# Altium schematic sheet FT232RLschematic.SchDoc
size A4; SheetNumber: 1; SheetTotal: 1
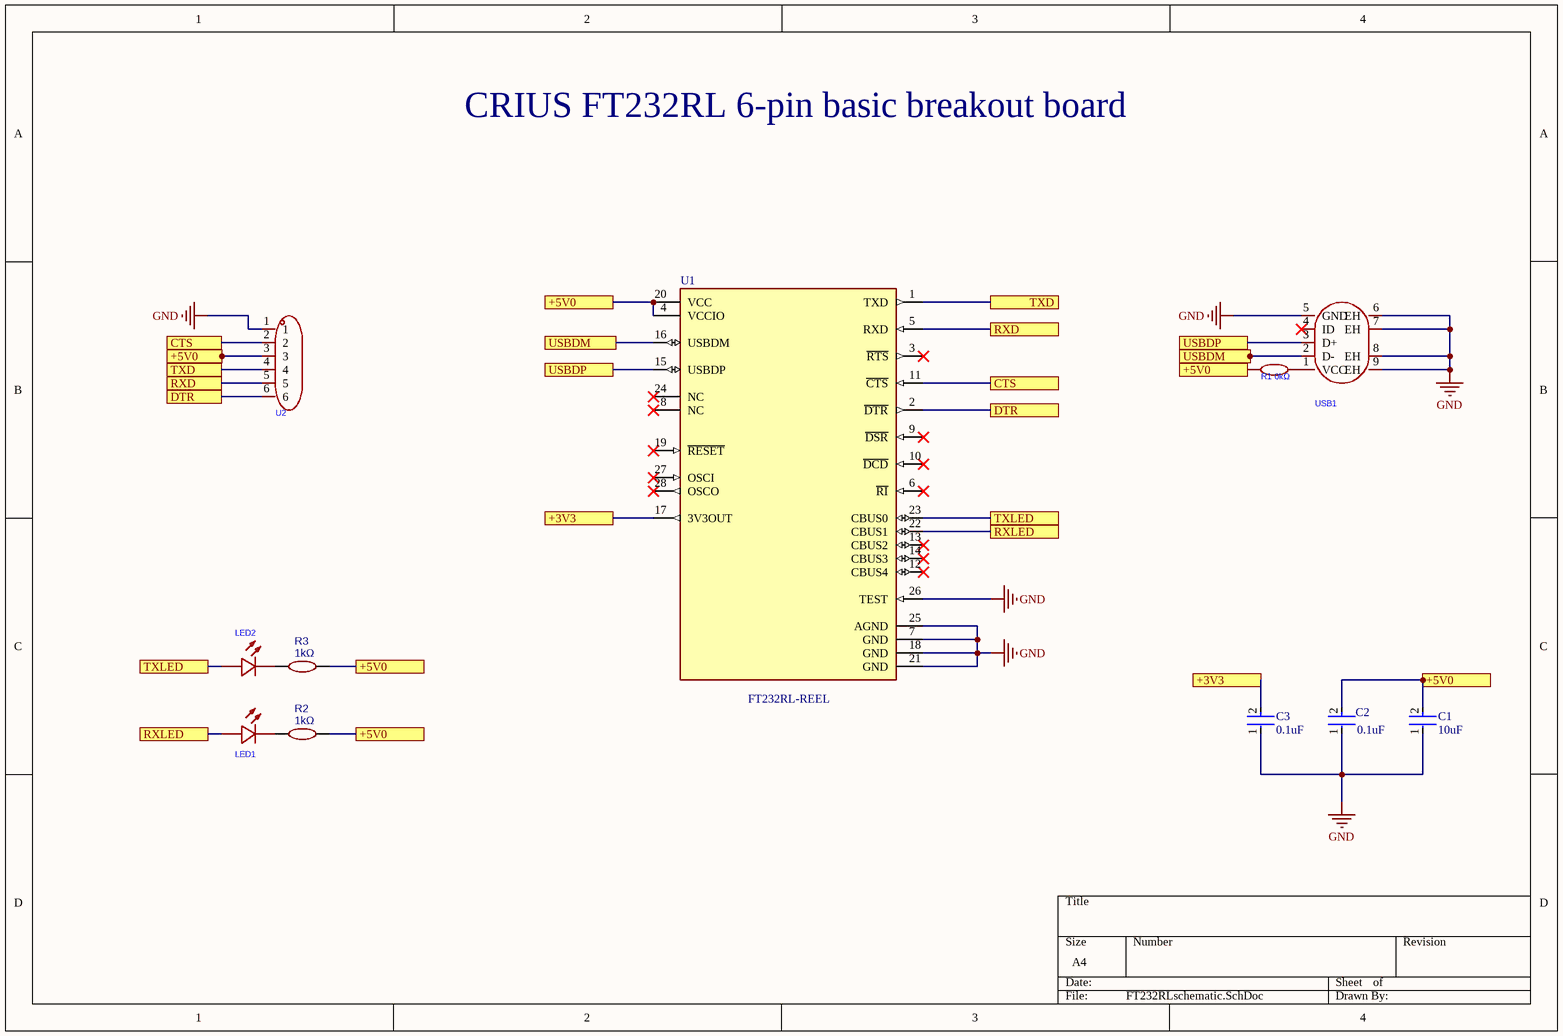
[diagram p0: FT232RLschematic.SchDoc]

## Parts
C1  10uF  [FP-GRM15-MFG]
C2  0.1uF  [FP-GRM15-MFG]
C3  0.1uF  [FP-GRM15-MFG]
LED1  YLED0603R  [LED0603-FD]  (value not drawn)
LED2  YLED0603R  [LED0603-FD]  (value not drawn)
R1  0kΩ  [R0805]
R2  1kΩ  [R0603]
R3  1kΩ  [R0603]
U1  FT232RL-REEL  [FP-SSOP-28-MFG]
U2  HB-PH3-25416PB2GOP  [HDR-TH_6P-P2.54-V-M]  (value not drawn)
USB1  KH-MINI-SMT-5P-Cu  [MINI-USB-SMD_KH-MINI-SMT-5P-CU]  (value not drawn)

## Ports
+3V3 (see FT232RLschematic[2C]), +3V3 (see FT232RLschematic[4C]), +5V0 (see FT232RLschematic[1B], FT232RLschematic[1C], FT232RLschematic[2B], FT232RLschematic[4B]), +5V0 (see FT232RLschematic[1B], FT232RLschematic[1C], FT232RLschematic[2B], FT232RLschematic[4B], FT232RLschematic[4C]), +5V0 (see FT232RLschematic[1B], FT232RLschematic[1C], FT232RLschematic[2B], FT232RLschematic[4C]), +5V0 (see FT232RLschematic[1B], FT232RLschematic[1C], FT232RLschematic[4B], FT232RLschematic[4C]), +5V0 (see FT232RLschematic[1C], FT232RLschematic[2B], FT232RLschematic[4B], FT232RLschematic[4C]), CTS (see FT232RLschematic[1B]), CTS (see FT232RLschematic[3B]), DTR (see FT232RLschematic[1B]), DTR (see FT232RLschematic[3B]), RXD (see FT232RLschematic[1B]), RXD (see FT232RLschematic[3B]), RXLED (see FT232RLschematic[1C]), RXLED (see FT232RLschematic[3C]), TXD (see FT232RLschematic[1B]), TXD (see FT232RLschematic[3B]), TXLED (see FT232RLschematic[1C]), TXLED (see FT232RLschematic[3C]), USBDM (see FT232RLschematic[2B]), USBDM (see FT232RLschematic[4B]), USBDP (see FT232RLschematic[2B]), USBDP (see FT232RLschematic[4B])

## Nets
GND: C1.1 C2.1 C3.1 U1.7(GND) U1.18(GND) U1.21(GND) U1.25(AGND) U1.26(TEST) U2.1 USB1.5(GND) USB1.6(EH) USB1.7(EH) USB1.8(EH) USB1.9(EH)
+3V3: C3.2 U1.17(3V3OUT) ; port +3V3
+5V0: C1.2 C2.2 R1.1 R2.2 R3.2 U1.4(VCCIO) U1.20(VCC) U2.3 ; port +5V0
CTS: U1.11(~{CTS}) U2.2 ; port CTS
DTR: U1.2(~{DTR}) U2.6 ; port DTR
RXD: U1.5(RXD) U2.5 ; port RXD
RXLED: LED1.1(+) U1.22(CBUS1) ; port RXLED
TXD: U1.1(TXD) U2.4 ; port TXD
TXLED: LED2.1(+) U1.23(CBUS0) ; port TXLED
USBDM: U1.16(USBDM) USB1.2(D-) ; port USBDM
USBDP: U1.15(USBDP) USB1.3(D+) ; port USBDP
NetLED1_2: LED1.2(-) R2.1
NetLED2_2: LED2.2(-) R3.1
NetR1_2: R1.2 USB1.1(VCC)

Not connected (* = marked no-connect by the designer): U1 3(~{RTS})* 6(~{RI})* 8(NC)* 9(~{DSR})* 10(~{DCD})* 12(CBUS4)* 13(CBUS2)* 14(CBUS3)* 19(~{RESET})* 24(NC)* 27(OSCI)* 28(OSCO)*; USB1 4(ID)*

## Notes on the sheet
- CRIUS FT232RL 6-pin basic breakout board

## Library data of the parts
C1-C3 = CMP-2100-03641-2: CAP CER 0.1UF 16V X7R 0402; Manufacturer Part Number: GRM155R71C104KA88D; Manufacturer: Murata; Standoff Height: 0mm; Tolerance: 10%; Description: CAP Ceramic 0.10μF 10% X7R 16Vdc 0402 SMD; Voltage Rating: 16Vdc; Material: Ceramic; Capacitance: 0.10μF; Value: 0.10μF; RoHS: TRUE; Temperature Characteristic: X7R; Octopart: https://octopart.com/grm155r71c104ka88d-murata-196880; Digikey Description: CAP CER 0.1UF 16V X7R 0402; Device Class L3: Ceramic Capacitors; Height: 0.55mm; ComponentLink2Description: Datasheet; Temperature Range Low: -55°C; Ipc Land Pattern Name: CAPC10050X219; ComponentLink2URL: https://search.murata.co.jp/Ceramy/image/img/A01X/G101/ENG/GRM155R71H471KA01-01A.pdf; Device Class L1: Passive Components; Lead Free: yes; Category: Cap; Package: GRM15; Temperature: -55°C to +125°C; Device Class L2: Capacitors; Temperature Range High: +125°C; Mouser Description: 0402 0.1 uF 16V ±10 % Tolerance X7R SMT Multilayer Ceramic Capacitor
LED1 LED2 = YLED0603R: Manufacturer: YONGYUTAI(永裕泰); Add into BOM: yes; Emitted Color: Red; Forward Voltage (VF): 1.8V~2.4V; Forward Current: 25mA; Dominant Wavelength: 620nm~625nm; Symbol: YLED0603R; Device: YLED0603R; LCSC Part Name: YLED0603R; Supplier Part: C19171390; Manufacturer Part: YLED0603R; Supplier Footprint: 0603; JLCPCB Part Class: Extended Part; Datasheet: https://atta.szlcsc.com/upload/public/pdf/source/20231027/FB19AF06E2C70028E58AB5CEDD1BDC72.pdf; Supplier: LCSC; Convert to PCB: yes; Power Dissipation: -; Peak Wavelength: -; Diode Configuration: -; Lens Color: -; Color Temperature: -; Luminous Intensity: -; Viewing Angle: -; Mounting Sytle: -; Operating Temperature: -40℃~+85℃
R1 = RC0805FR-0710KL: Manufacturer: YAGEO(国巨); Add into BOM: yes; Value: 10kΩ; Tolerance: ±1%; Temperature Coefficient: ±100ppm/℃; Symbol: RC0805FR-0710KL; Device: RC0805FR-0710KL; LCSC Part Name: 厚膜电阻 10kΩ ±1% 125mW; Supplier Part: C84376; Manufacturer Part: RC0805FR-0710KL; Supplier Footprint: 0805; JLCPCB Part Class: Extended Part; Datasheet: https://atta.szlcsc.com/upload/public/pdf/source/20170708/1499509500945.pdf; Supplier: LCSC; Convert to PCB: yes; Type: Thick Film Resistors; Operating Temperature Range: -55℃~+155℃
R2 R3 = 1kΩ: Manufacturer Part: RC0603FR-071KL; Manufacturer: YAGEO(国巨); nameAlias: Value; Supplier: LCSC; Supplier Part: C22548; JLCPCB Part Class: Extended Part; spicePre: R; spiceSymbolName: RC0603FR-071KL
U1 = CMP-0078-00029-4: IC USB FS SERIAL UART 28-SSOP; Data Rate: 12Mbps; Max Supply Voltage: 5.25V; Operating Supply Current: 15mA; Number of Channels: 1; Voltage: 5V; Min Supply Voltage: 3.3V; Radiation Hardening: No; Mount: Surface Mount; Min Operating Temperature: -40°C; Package Quantity: 2000; Number of Transceivers: 1; Width: 5.3mm; Number of Pins: 28; Height: 1.75mm; Weight: 0.080001oz; Lead Free: Lead Free; Length: 10.2mm; REACH SVHC: No SVHC; Max Operating Temperature: 85°C; Packaging: Tape and Reel; Interface: UART; Case/Package: SSOP
U2 = HB-PH3-25416PB2GOP: Manufacturer: HANBO(汉博); Add into BOM: yes; Pin Structure: 1x6P; Pitch: 2.54mm; Circluar Pins/Square Pins: Policy; Current Rating: 3A; Voltage Rating (Max): 250V; Symbol: HB-PH3-25416PB2GOP; Device: HB-PH3-25416PB2GOP; LCSC Part Name: 1x6P 间距:2.54mm 方针 直插; Supplier Part: C6332199; Manufacturer Part: HB-PH3-25416PB2GOP; Supplier Footprint: 插件,P=2.54mm; JLCPCB Part Class: Extended Part; Datasheet: https://atta.szlcsc.com/upload/public/pdf/source/20230803/F72D259687963761DF1B552F3BB84A31.pdf; Supplier: LCSC; Convert to PCB: yes; Row Spacing: 2.54mm; Mounting Type: Straight; Number of Rows: Single Row; Number of Pins: 6P; Length of Mating Pin: 6mm; Insulation Height: 2.54mm; Length of End Connection Pin: 3mm; Contact Material: Brass; Contact Plating: Gold; Operating Temperature: -40℃~+105℃; Color: Black
USB1 = KH-MINI-SMT-5P-Cu: Manufacturer: kinghelm(金航标); Add into BOM: yes; Connector Type: Mini-B; Gender: Female; Number of Ports: 1; Number of Contacts: 5P; Current Rating - Power (Max): 1A; Symbol: KH-MINI-SMT-5P-CU; Device: KH-MINI-SMT-5P-Cu; LCSC Part Name: Mini-B 母 卧贴; Supplier Part: C2688795; Manufacturer Part: KH-MINI-SMT-5P-Cu; Supplier Footprint: SMD; JLCPCB Part Class: Extended Part; Datasheet: https://atta.szlcsc.com/upload/public/pdf/source/20210202/C2688795_BF0BB16DAD2ABFC9845DEEA6AC1A1F9C.pdf; Supplier: LCSC; Convert to PCB: yes; Standard: USB 2.0; Mounting Style: 卧贴; Contact Material: -; Contact Plating: -; Operating Temperature Range: -; Soldering Temperature(Max): -